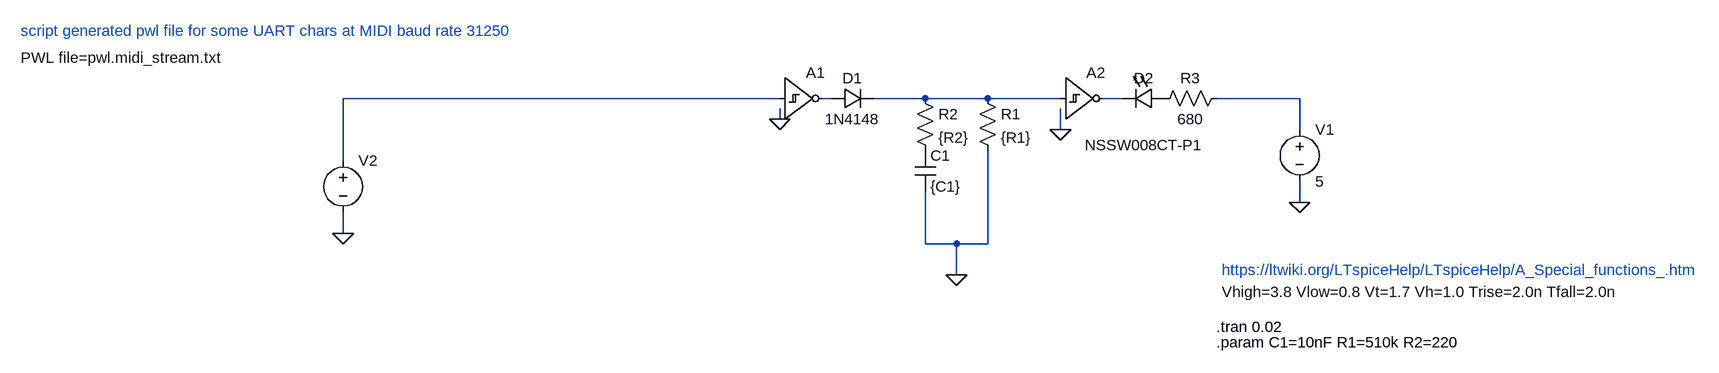
[diagram p0: schematic midi_rx_tx_indicator.asc]
midi_rx_tx_indicator.asc, the LTspice schematic file:
Version 4
SHEET 1 2224 680
WIRE 96 144 -576 144
WIRE 176 144 160 144
WIRE 320 144 240 144
WIRE 416 144 320 144
WIRE 528 144 416 144
WIRE 624 144 592 144
WIRE 896 144 768 144
WIRE 96 176 96 160
WIRE 528 192 528 160
WIRE 896 192 896 144
WIRE -576 240 -576 144
WIRE 896 304 896 272
WIRE -576 352 -576 320
WIRE 320 368 320 288
WIRE 368 368 320 368
WIRE 416 368 416 224
WIRE 416 368 368 368
WIRE 368 416 368 368
FLAG 368 416 0
FLAG -576 352 0
FLAG 896 304 0
FLAG 96 176 0
FLAG 528 192 0
SYMBOL Digital\\schmtinv 96 80 R0
WINDOW 3 680 362 Left 2
SYMATTR Value Vhigh=3.8 Vlow=0.8 Vt=1.7 Vh=1.0 Trise=2.0n Tfall=2.0n
SYMATTR InstName A1
SYMBOL diode 176 160 R270
WINDOW 0 32 32 VTop 2
WINDOW 3 0 32 VBottom 2
SYMATTR InstName D1
SYMATTR Value 1N4148
SYMBOL res 400 128 R0
SYMATTR InstName R1
SYMATTR Value {R1}
SYMBOL res 304 128 R0
SYMATTR InstName R2
SYMATTR Value {R2}
SYMBOL cap 304 224 R0
SYMATTR InstName C1
SYMATTR Value {C1}
SYMBOL Digital\\schmtinv 528 80 R0
WINDOW 3 0 0 Invisible 0
SYMATTR Value Vhigh=3.8 Vlow=0.8 Vt=1.7 Vh=1.0 Trise=2.0n Tfall=2.0n
SYMATTR InstName A2
SYMBOL LED 688 128 R90
WINDOW 0 0 32 VBottom 2
WINDOW 3 72 32 VTop 2
SYMATTR InstName D2
SYMATTR Value NSSW008CT-P1
SYMBOL voltage 896 176 R0
WINDOW 123 0 0 Left 0
WINDOW 39 0 0 Left 0
SYMATTR InstName V1
SYMATTR Value 5
SYMBOL voltage -576 224 R0
WINDOW 3 -496 -143 Left 2
WINDOW 123 0 0 Left 0
WINDOW 39 0 0 Left 0
SYMATTR Value PWL file=pwl.midi_stream.txt
SYMATTR InstName V2
SYMBOL res 784 128 R90
WINDOW 0 0 56 VBottom 2
WINDOW 3 32 56 VTop 2
SYMATTR InstName R3
SYMATTR Value 680
TEXT 768 496 Left 2 !.tran 0.02
TEXT 768 520 Left 2 !.param C1=10nF R1=510k R2=220
TEXT 776 408 Left 2 ;https://ltwiki.org/LTspiceHelp/LTspiceHelp/A_Special_functions_.htm
TEXT -1072 40 Left 2 ;script generated pwl file for some UART chars at MIDI baud rate 31250

The netlist it stands for:
* midi_rx_tx_indicator.asc
A1 N001 0 0 0 0 N002 0 0 SCHMITT Vhigh=3.8 Vlow=0.8 Vt=1.7 Vh=1.0 Trise=2.0n Tfall=2.0n
D1 N002 N003 1N4148
R1 N003 0 {R1}
R2 N003 P001 {R2}
C1 P001 0 {C1}
A2 N003 0 0 0 0 N004 0 0 SCHMITT Vhigh=3.8 Vlow=0.8 Vt=1.7 Vh=1.0 Trise=2.0n Tfall=2.0n
D2 P002 N004 NSSW008CT-P1
V1 N005 0 5
V2 N001 0 PWL file=pwl.midi_stream.txt
R3 N005 P002 680
.model D D
.lib standard.dio
.tran 0.02
.param C1=10nF R1=510k R2=220
* https://ltwiki.org/LTspiceHelp/LTspiceHelp/A_Special_functions_.htm
* script generated pwl file for some UART chars at MIDI baud rate 31250
.backanno
.end